# Altium schematic sheet main.SchDoc: Main
size A4; PageSetup: Record=PageOptions|CenterHorizontal=True|CenterVertical=True|PrintScale=0.97|XCorrection=1.00|YCorrection=1.00|PrintKind=0|BorderSize=5000000|LeftOffset=0|BottomOffset=0|Orientation=2|PaperLength=1000|PaperWidth=1000|Scale=100|PaperSource=273|PrintQuality=-2|MediaType=1|DitherType=10|PaperKind=A4|PrintScaleMode=1; Organization: Altium Limited; Address1: 3 Minna Close; Address2: Belrose; Address3: NSW 2085; Address4: Australia; DocumentName: test
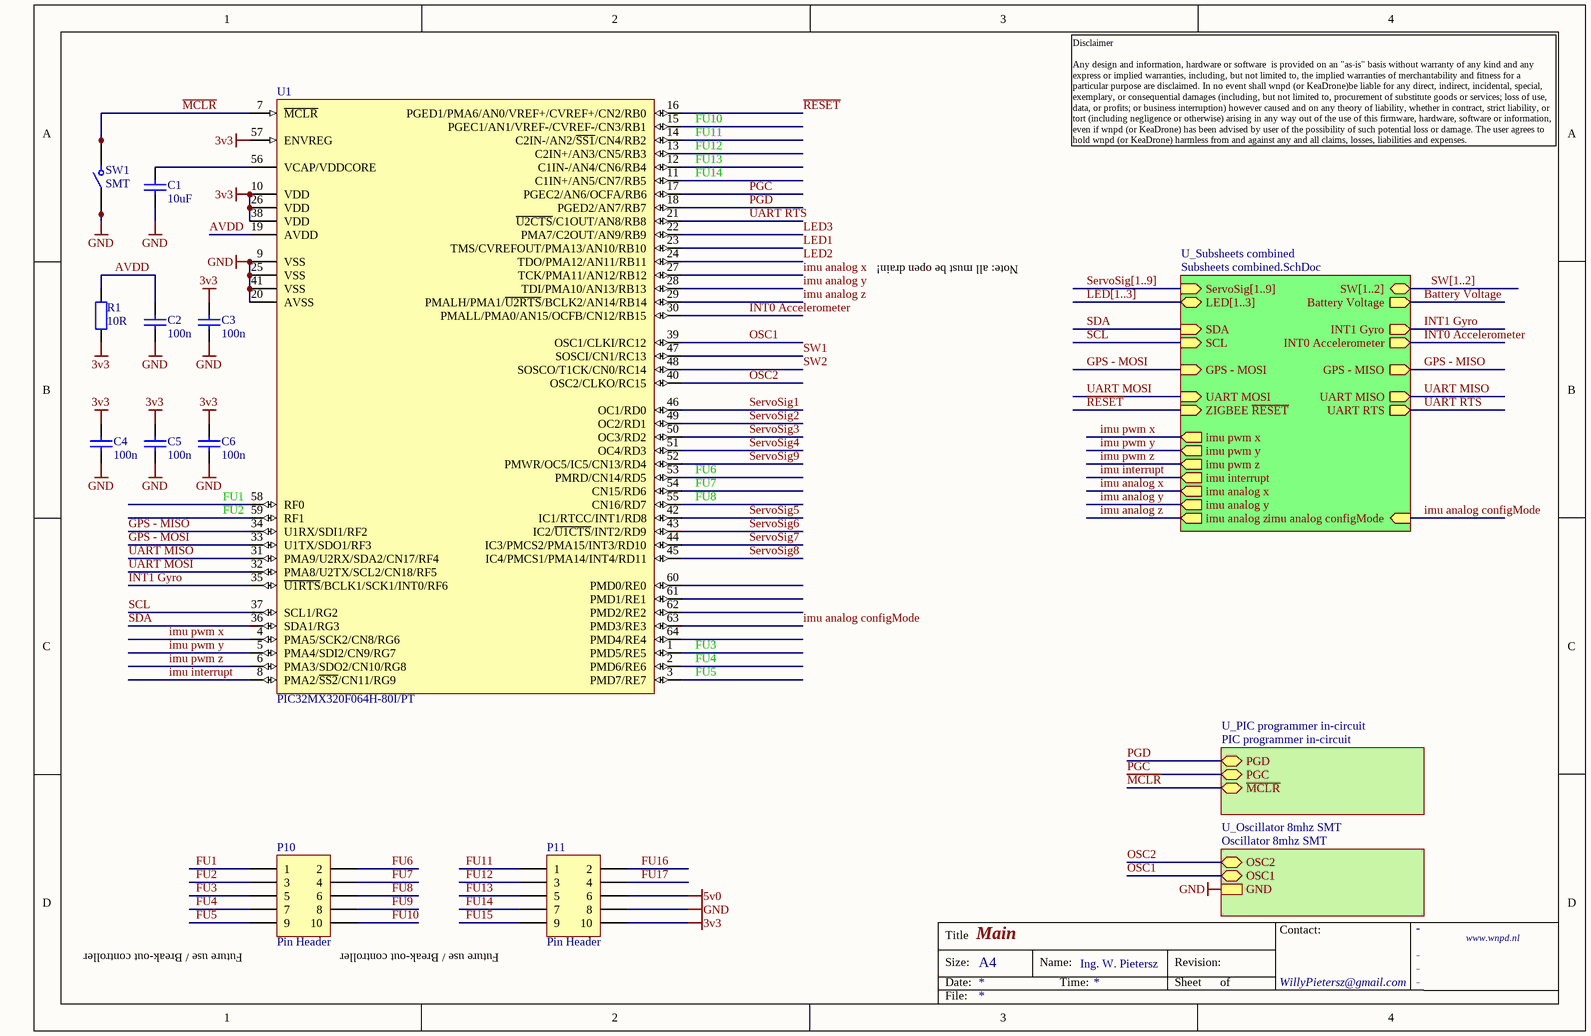
[diagram p0: main.SchDoc]

## Parts
C1  10uF  [C1206]
C2  100n  [C0805]
C3  100n  [C0805]
C4  100n  [C0805]
C5  100n  [C0805]
C6  100n  [C0805]
P10  Pin Header  [PH2x5_2.54]
P11  Pin Header  [PH2x5_2.54]
R1  value 10R  [R0805]  (hidden comment: RESISTOR)
SW1  SMT  [SWITCH TACT]
U1  PIC32MX320F064H-80I/PT  [TQFP-PT64_N]

## Sub-sheets
U_Oscillator 8mhz SMT = Oscillator 8mhz SMT: OSC2 (bidir), OSC1 (bidir), GND
U_PIC programmer in-circuit = PIC programmer in-circuit: PGD (bidir), PGC (bidir), ~{MCLR} (bidir)
U_Subsheets combined = Subsheets combined.SchDoc: ServoSig[1..9], INT0 Accelerometer (out), INT1 Gyro (out), UART MISO (out), UART MOSI (in), ZIGBEE ~{RESET} (in), SDA (in), SCL (in), Battery Voltage (out), GPS - MISO (out), GPS - MOSI (in), LED[1..3] (bidir), SW[1..2], imu pwm x (out), imu pwm y (out), imu pwm z (out), imu interrupt (out), imu analog x (out), imu analog y (out), imu analog z (out), imu analog configMode (in), UART RTS (out)

## Nets
3v3: C3.2 C4.2 C5.2 C6.2 P11.10 R1.2 U1.10(VDD) U1.26(VDD) U1.38(VDD) U1.57(ENVREG)
5v0: P11.6
GND: C1.1 C2.1 C3.1 C4.1 C5.1 C6.1 P11.8 SW1.1 SW1.4 U1.9(VSS) U1.20(AVSS) U1.25(VSS) U1.41(VSS) ; sheet U_Oscillator 8mhz SMT/GND
AVDD: C2.2 R1.1 U1.19(AVDD)
Battery Voltage: sheet U_Subsheets combined/Battery Voltage
FU1: P10.1 U1.58(RF0)
FU2: P10.3 U1.59(RF1)
FU3: P10.5 U1.1(PMD5/RE5)
FU4: P10.7 U1.2(PMD6/RE6)
FU5: P10.9 U1.3(PMD7/RE7)
FU6: P10.2 U1.53(PMRD/CN14/RD5)
FU7: P10.4 U1.54(CN15/RD6)
FU8: P10.6 U1.55(CN16/RD7)
FU9: P10.8
FU10: P10.10 U1.15(PGEC1/AN1/VREF-/CVREF-/CN3/RB1)
FU11: P11.1 U1.14(C2IN-/AN2/~{SS1}/CN4/RB2)
FU12: P11.3 U1.13(C2IN+/AN3/CN5/RB3)
FU13: P11.5 U1.12(C1IN-/AN4/CN6/RB4)
FU14: P11.7 U1.11(C1IN+/AN5/CN7/RB5)
FU15: P11.9
FU16: P11.2
FU17: P11.4
GPS - MISO: U1.34(U1RX/SDI1/RF2) ; sheet U_Subsheets combined/GPS - MISO
GPS - MOSI: U1.33(U1TX/SDO1/RF3) ; sheet U_Subsheets combined/GPS - MOSI
imu analog configMode: U1.63(PMD3/RE3) ; sheet U_Subsheets combined/imu analog configMode
imu analog x: U1.27(TCK/PMA11/AN12/RB12) ; sheet U_Subsheets combined/imu analog x
imu analog y: U1.28(TDI/PMA10/AN13/RB13) ; sheet U_Subsheets combined/imu analog y
imu analog z: U1.29(PMALH/PMA1/~{U2RTS}/BCLK2/AN14/RB14) ; sheet U_Subsheets combined/imu analog z
imu interrupt: U1.8(PMA2/~{SS2}/CN11/RG9) ; sheet U_Subsheets combined/imu interrupt
imu pwm x: U1.4(PMA5/SCK2/CN8/RG6) ; sheet U_Subsheets combined/imu pwm x
imu pwm y: U1.5(PMA4/SDI2/CN9/RG7) ; sheet U_Subsheets combined/imu pwm y
imu pwm z: U1.6(PMA3/SDO2/CN10/RG8) ; sheet U_Subsheets combined/imu pwm z
INT0 Accelerometer: U1.30(PMALL/PMA0/AN15/OCFB/CN12/RB15) ; sheet U_Subsheets combined/INT0 Accelerometer
INT1 Gyro: U1.35(~{U1RTS}/BCLK1/SCK1/INT0/RF6) ; sheet U_Subsheets combined/INT1 Gyro
LED1: U1.23(TMS/CVREFOUT/PMA13/AN10/RB10)
LED2: U1.24(TDO/PMA12/AN11/RB11)
LED3: U1.22(PMA7/C2OUT/AN9/RB9)
~{MCLR}: SW1.2 SW1.3 U1.7(~{MCLR}) ; sheet U_PIC programmer in-circuit/~{MCLR}
OSC1: U1.39(OSC1/CLKI/RC12) ; sheet U_Oscillator 8mhz SMT/OSC1
OSC2: U1.40(OSC2/CLKO/RC15) ; sheet U_Oscillator 8mhz SMT/OSC2
PGC: U1.17(PGEC2/AN6/OCFA/RB6) ; sheet U_PIC programmer in-circuit/PGC
PGD: U1.18(PGED2/AN7/RB7) ; sheet U_PIC programmer in-circuit/PGD
~{RESET}: U1.16(PGED1/PMA6/AN0/VREF+/CVREF+/CN2/RB0) ; sheet U_Subsheets combined/ZIGBEE ~{RESET}
SCL: U1.37(SCL1/RG2) ; sheet U_Subsheets combined/SCL
SDA: U1.36(SDA1/RG3) ; sheet U_Subsheets combined/SDA
ServoSig1: U1.46(OC1/RD0)
ServoSig2: U1.49(OC2/RD1)
ServoSig3: U1.50(OC3/RD2)
ServoSig4: U1.51(OC4/RD3)
ServoSig5: U1.42(IC1/RTCC/INT1/RD8)
ServoSig6: U1.43(IC2/~{U1CTS}/INT2/RD9)
ServoSig7: U1.44(IC3/PMCS2/PMA15/INT3/RD10)
ServoSig8: U1.45(IC4/PMCS1/PMA14/INT4/RD11)
ServoSig9: U1.52(PMWR/OC5/IC5/CN13/RD4)
SW1: U1.47(SOSCI/CN1/RC13)
SW2: U1.48(SOSCO/T1CK/CN0/RC14)
UART MISO: U1.31(PMA9/U2RX/SDA2/CN17/RF4) ; sheet U_Subsheets combined/UART MISO
UART MOSI: U1.32(PMA8/U2TX/SCL2/CN18/RF5) ; sheet U_Subsheets combined/UART MOSI
UART RTS: U1.21(~{U2CTS}/C1OUT/AN8/RB8) ; sheet U_Subsheets combined/UART RTS
NetC1_2: C1.2 U1.56(VCAP/VDDCORE)

Not connected (* = marked no-connect by the designer): U1 60(PMD0/RE0) 61(PMD1/RE1) 62(PMD2/RE2) 64(PMD4/RE4)

## Buses and harness runs
bus LED[1..3] = sheet U_Subsheets combined/LED[1..3]
bus ServoSig[1..9] = sheet U_Subsheets combined/ServoSig[1..9]
bus SW[1..2] = sheet U_Subsheets combined/SW[1..2]

## Notes on the sheet
- Note: all must be open drain!
- (near P10) Future use / Break-out controller
- (near P11) Future use / Break-out controller
- Disclaimer
  Any design and information, hardware or software  is provided on an "as-is" basis without warranty of any kind and any express or implied warranties, including, but not limited to, the implied warranties of merchantability and fitness for a particular purpose are disclaimed. In no event shall wnpd (or KeaDrone)be liable for any direct, indirect, incidental, special, exemplary, or consequential damages (including, but not limited to, procurement of substitute goods or services; loss of use, data, or profits; or business interruption) however caused and on any theory of liability, whether in contract, strict liability, or tort (including negligence or otherwise) arising in any way out of the use of this firmware, hardware, software or information, even if wnpd (or KeaDrone) has been advised by user of the possibility of such potential loss or damage. The user agrees to hold wnpd (or KeaDrone) harmless from and against any and all claims, losses, liabilities and expenses.
- Title
- Size:
- Date:
- A4
- Name:
- Time:
- Ing. W. Pietersz
- Revision:
- Sheet
- of
- WillyPietersz@gmail.com
- Contact:
- -
- www.wnpd.nl
- File:

## Library data of the parts
C1 = 10uF: Voltage: 10V; Type: Ceramic; Tolerance: 0.1; LatestRevision Note: Initial Release; Part Number: 10uF; Value: 10uF; Package: 1206; Component Type: Standard; LatestRevision Date: 14-9-2010; Author: Willem Pietersz; Supplier 1: Farnell; Supplier Part Number 1: 1759434; ComponentLink1Description: Manufacturer; ComponentLink2Description: Datasheet
C2-C6 = 100n: Tolerance: 0.1; LatestRevision Note: Initial Release; Part Number: 100n; Value: 100n; Package: 0805; Component Type: Standard; LatestRevision Date: 31-7-2010; Author: Willy Pietersz; Supplier 1: Farnell; Supplier Part Number 1: 1759266; ComponentLink1Description: Manufacturer; ComponentLink2Description: Datasheet
P10 P11 = PH2x5: Header, 5-Pin, Dual row; Part Number: PH2x5; Pitch: 2.54; LatestRevision Note: Initial Release; Type: Pin Header; Number Of Pins: 10; Component Type: Standard; LatestRevision Date: 23-11-2010; Author: Willy Pietersz; Supplier 1: Farnell
R1 = 10R: Manufacturer 1: Panasonic; Manufacturer 1 Part No: ERJT06J100V; Power: 0.25W; Tolerance: 0.05; LatestRevision Note: Initial Release; Published: 8-Jun-2000; LatestRevisionDate: 17-Jul-2002; LatestRevisionNote: Re-released for DXP Platform.; PackageReference: AXIAL-0.4; Publisher: Altium Limited; Part Number: 10R; Type: Film; Package: 0805; Component Type: Standard; LatestRevision Date: 30-7-2010; Author: Willy Pietersz; ROHS: Y; Supplier 1: Farnell; Supplier Part Number 1: 1618239; ComponentLink1Description: Manufacturer; ComponentLink2Description: Datasheet
SW1 = Pushbutton TACT: Switch; Current: 0.1; Voltage: 42; LatestRevision Note: Initial Release; Part Number: Pushbutton TACT; Component Type: Switch; LatestRevision Date: 4-10-2010; Author: Willem Pietersz; Supplier 2: Farnell; Supplier Part Number 2: 1795335; Number Of Pins: 4
U1 = PIC32MX320F064H-80I/PT: High Performance 80 MHz MIPS-Based 32-Bit Flash Microcontroller, 64KB Program Memory, 64-pin TQFP; FirstPublished: 29-Jan-2009; LatestRevisionDate: 2-Dec-2009; LatestRevisionNote: Datasheet updated to version revF, Jun-2009.; DatasheetVersion: revF, Jun-2009; PackageVersion: revBB, Aug-2009; PackageReference: TQFP-PT64; Publisher: Altium Limited; PackageDescription: 64-Lead Thin Plastic Quad Flat Pack (PT) - 10x10x1mm Body, 2.00mm [TQFP]; Supplier 1: Digi-Key; Supplier Part Number 1: PIC32MX320F064H-80I/PT-ND; Supplier 2: Farnell; Supplier Part Number 2: 1523319; Supplier 3: Newark; Supplier Part Number 3: 77M3147; Code_JEDEC: MS-026; ComponentLink1Description: Datasheet; ComponentLink1URL: http://ww1.microchip.com/downloads/en/DeviceDoc/61143F.pdf; ComponentLink2Description: Packaging Specification; ComponentLink2URL: http://ww1.microchip.com/downloads/en/PackagingSpec/en012702.pdf; ComponentLink3Description: Microchip.com Home; ComponentLink3URL: http://www.microchip.com/